# EAGLE design touchsensor (EAGLE 7.2.0)
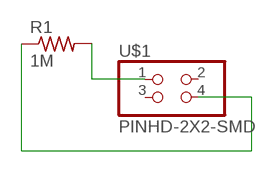
[diagram p0: schematic, sheet 1]

## Parts
R1  1M  RES-US1206FAB  [R1206FAB]
U$1  PINHD-2X2-SMD  [2X02SMD]

## Nets
N$1: R1.1 U$1.4
N$3: R1.2 U$1.1
Unconnected: U$1.2 U$1.3

## Library data of the parts
R1 = fab:RES-US: Resistor (US Symbol) Variants with postfix FAB are widened to allow the routing of internal traces
U$1 = fab:PINHD-2X2-SMD

## Board
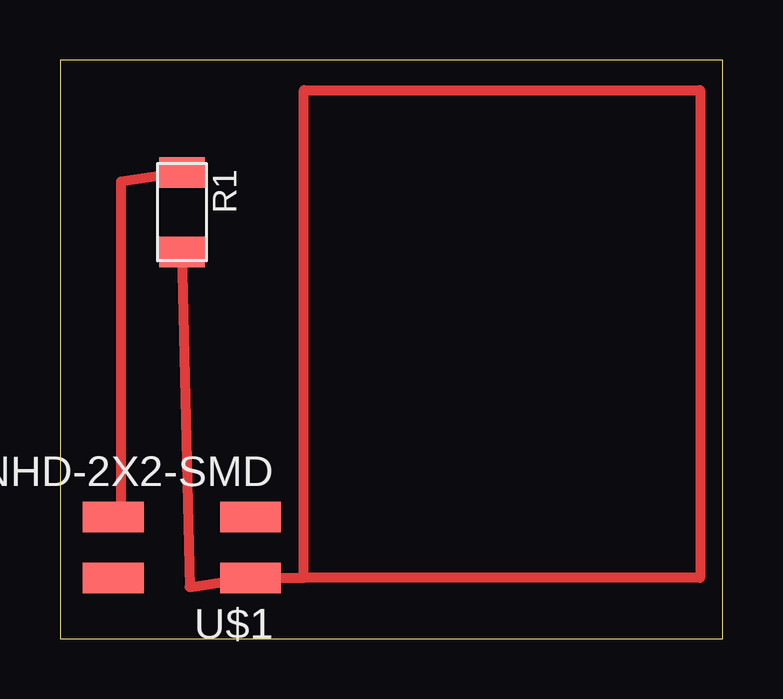
[diagram p1: board, top side]

Size 27.61 x 24.12 mm. Coordinates in mm from the lower left corner, seen from the top.
Outline: 0,0 27.61,0 27.61,24.12 0,24.12 0,0
Copper layers (1*16): Top 0.035mm / dielectric 1.5mm / Bottom 0.035mm
Design rules "default": minimum track width 10mil, minimum drill 24mil, track to track 8mil, track to pad 8mil, pad to pad 8mil, via to via 8mil, smd to smd 8mil, copper to edge 40mil, drill to drill 8mil, minimum pad ring 10mil, minimum via ring 8mil, stop-mask expansion 4mil, vias tented up to drill 0mil, thermal gap 10mil

### Footprints (pad centres in the part's own frame; a part is rotated, then mirrored left to right if it is on the bottom)
R1206FAB = smd 1.27 x 1.905: 1 -1.651,0; 2 1.651,0
2X02SMD = smd 2.54 x 1.27: 1 -2.857,1.27; 2 2.857,1.27; 3 -2.857,-1.27; 4 2.857,-1.27

### Placement (x,y rotation side)
R1  5.08,17.78 270 top
U$1  5.08,3.81 180 top

### Tracks (layer width: path | path; a pad name or v marks a point on that pad's centre or on a via)
N$1
  Top 0.406: R1.1 2.54,19.05 2.54,5.08 U$1.4
N$2
  Top 0.406: 7.62,2.54 10.16,2.54 | 10.16,2.54 10.16,22.86 26.67,22.86 26.67,2.54 10.16,2.54
N$3
  Top 0.406: R1.2 5.4,2.16 U$1.1